# Altium schematic sheet MIXR Input - Board to Board Connectors.SchDoc: Processing & Power Board Connector
size B; Organization: Midnight Sun Solar Rayce Car Team; Address1: University of Waterloo; Address2: 200 University Ave W; Address3: Waterloo, ON, Canada; Address4: N2L 3E9; DocumentNumber: 2; SheetNumber: 2; SheetTotal: 14; Website: www.uwmidsun.com; ProjectName: ProjectName
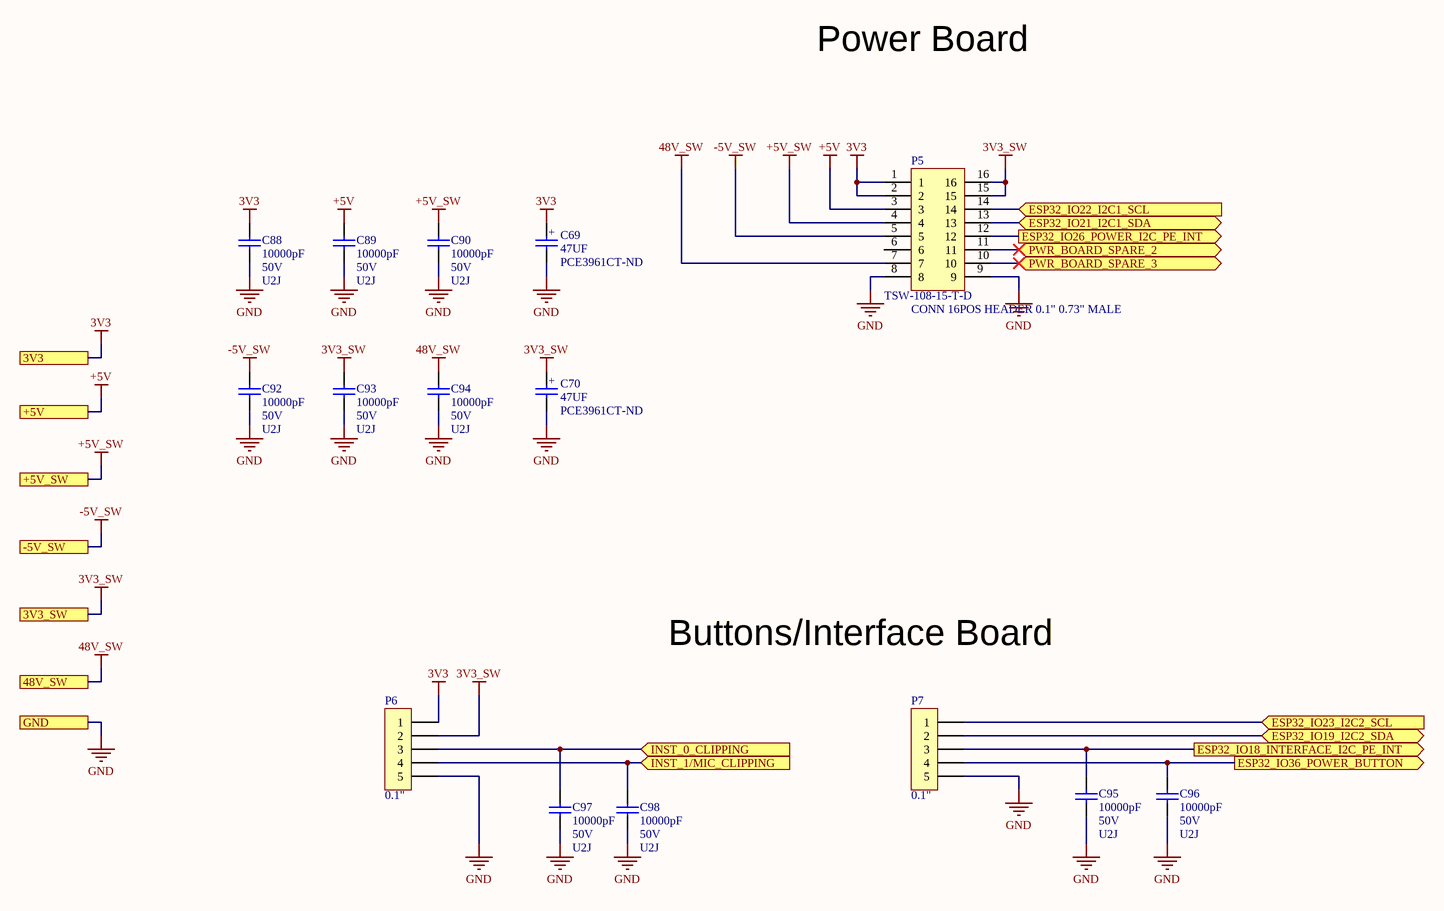
[diagram p0: MIXR Input - Board to Board Connectors.SchDoc]

## Parts
C69  47UF  Supplier Part Number 1: PCE3961CT-ND  [CAP ALUM 6.3MM RADIAL SMD]
C70  47UF  Supplier Part Number 1: PCE3961CT-ND  [CAP ALUM 6.3MM RADIAL SMD]
C88  Capacitance: 10000pF  Voltage: 50V  Temperature Coefficient: U2J  [CAP, 0603]  (hidden comment: CAP CER 10nF 50V 5% X7R 0603)
C89  Capacitance: 10000pF  Voltage: 50V  Temperature Coefficient: U2J  [CAP, 0603]  (hidden comment: CAP CER 10nF 50V 5% X7R 0603)
C90  Capacitance: 10000pF  Voltage: 50V  Temperature Coefficient: U2J  [CAP, 0603]  (hidden comment: CAP CER 10nF 50V 5% X7R 0603)
C92  Capacitance: 10000pF  Voltage: 50V  Temperature Coefficient: U2J  [CAP, 0603]  (hidden comment: CAP CER 10nF 50V 5% X7R 0603)
C93  Capacitance: 10000pF  Voltage: 50V  Temperature Coefficient: U2J  [CAP, 0603]  (hidden comment: CAP CER 10nF 50V 5% X7R 0603)
C94  Capacitance: 10000pF  Voltage: 50V  Temperature Coefficient: U2J  [CAP, 0603]  (hidden comment: CAP CER 10nF 50V 5% X7R 0603)
C95  Capacitance: 10000pF  Voltage: 50V  Temperature Coefficient: U2J  [CAP, 0603]  (hidden comment: CAP CER 10nF 50V 5% X7R 0603)
C96  Capacitance: 10000pF  Voltage: 50V  Temperature Coefficient: U2J  [CAP, 0603]  (hidden comment: CAP CER 10nF 50V 5% X7R 0603)
C97  Capacitance: 10000pF  Voltage: 50V  Temperature Coefficient: U2J  [CAP, 0603]  (hidden comment: CAP CER 10nF 50V 5% X7R 0603)
C98  Capacitance: 10000pF  Voltage: 50V  Temperature Coefficient: U2J  [CAP, 0603]  (hidden comment: CAP CER 10nF 50V 5% X7R 0603)
P5  CONN 16POS HEADER 0.1" 0.73" MALE  Manufacturer Part Number: TSW-108-15-T-D  [CONN, 16POS 0.100" 0.73" MALE]
P6  0.1"  [CONN, 5POS 1.23" 0.100" MALE Header]
P7  0.1"  [CONN, 5POS 1.23" 0.100" MALE Header]

## Ports
3V3, 3V3_SW, 48V_SW, +5V, +5V_SW, -5V_SW, ESP32_IO18_INTERFACE_I2C_PE_INT (out), ESP32_IO19_I2C2_SDA (bidir), ESP32_IO21_I2C1_SDA (bidir), ESP32_IO22_I2C1_SCL (in), ESP32_IO23_I2C2_SCL (in), ESP32_IO26_POWER_I2C_PE_INT (out), ESP32_IO36_POWER_BUTTON (out), GND, INST_0_CLIPPING (in), INST_1/MIC_CLIPPING (in), PWR_BOARD_SPARE_2 (bidir), PWR_BOARD_SPARE_3 (bidir)

## Nets
3V3: C69.1 C88.1 P5.1 P5.2 P6.1 ; port 3V3
3V3_SW: C70.1 C93.1 P5.15 P5.16 P6.2 ; port 3V3_SW
48V_SW: C94.1 P5.7 ; port 48V_SW
+5V: C89.1 P5.3 ; port +5V
+5V_SW: C90.1 P5.4 ; port +5V_SW
-5V_SW: C92.1 P5.5 ; port -5V_SW
GND: C69.2 C70.2 C88.2 C89.2 C90.2 C92.2 C93.2 C94.2 C95.2 C96.2 C97.2 C98.2 P5.8 P5.9 P6.5 P7.5 ; port GND
ESP32_IO18_INTERFACE_I2C_PE_INT: C95.1 P7.3 ; port ESP32_IO18_INTERFACE_I2C_PE_INT
ESP32_IO19_I2C2_SDA: P7.2 ; port ESP32_IO19_I2C2_SDA
ESP32_IO21_I2C1_SDA: P5.13 ; port ESP32_IO21_I2C1_SDA
ESP32_IO22_I2C1_SCL: P5.14 ; port ESP32_IO22_I2C1_SCL
ESP32_IO23_I2C2_SCL: P7.1 ; port ESP32_IO23_I2C2_SCL
ESP32_IO26_POWER_I2C_PE_INT: P5.12 ; port ESP32_IO26_POWER_I2C_PE_INT
ESP32_IO36_POWER_BUTTON: C96.1 P7.4 ; port ESP32_IO36_POWER_BUTTON
INST_0_CLIPPING: C97.1 P6.3 ; port INST_0_CLIPPING
INST_1/MIC_CLIPPING: C98.1 P6.4 ; port INST_1/MIC_CLIPPING
PWR_BOARD_SPARE_2: P5.11 ; port PWR_BOARD_SPARE_2
PWR_BOARD_SPARE_3: P5.10 ; port PWR_BOARD_SPARE_3

Not connected (* = marked no-connect by the designer): P5 6

## Notes on the sheet
- Power Board
- Buttons/Interface Board
- PROJECT
- DOCUMENT
- DRAWN BY
- LAST MODIFIED
- PART NUMBER
- REVISION
- SHEET
- VARIANT
- OF
- (in symbol CAP ALUM 47UF 20% 35V SMD) +

## Library data of the parts
C69 C70 = CAP ALUM 47UF 20% 35V SMD: 47µF 35V Aluminum Electrolytic Capacitors Radial, Can - SMD 1000 Hrs @ 85°C; Manufacturer: Panasonic; Manufacturer Part Number: EEE-1VA470WP; Tolerance: 20%; Ripple Current: 70mA; Life (Hours): 1000Hour; Supplier 1: Digi-Key; Stock 1: 2820; Pricing 1: 1=0.38, 10=0.263, 100=0.1579, 500=0.11846 (USD); Mount: Surface Mount,PCB; Case/Package: Radial; Contact Plating: Tin; Min Operating Temperature: -40°C; Max Operating Temperature: 85°C; Capacitance: 47uF; Voltage Rating (DC): 35V; Voltage Rating: 35V; Packaging: Tape and Reel; Package Quantity: 1; Ripple Current (AC): 70mA; Termination: SMD/SMT; Diameter: 6.3mm; Length: 5.5mm; Height: 5.4mm; Height - Seated (Max): 0.213inch; Radiation Hardening: No; REACH SVHC: Unknown; Lead Free: Lead Free; ComponentLink1URL: https://datasheet.ciiva.com/2983/aba0000ce2-2983926.pdf; ComponentLink1Description: https://datasheet.ciiva.com/2983/aba0000ce2-2983926.pdf; ComponentLink2URL: https://datasheet.ciiva.com/2983/aba0000ce2-2983927.pdf; ComponentLink2Description: https://datasheet.ciiva.com/2983/aba0000ce2-2983927.pdf; ComponentLink3URL: https://datasheet.ciiva.com/14598/70255710-14598937.pdf; ComponentLink3Description: https://datasheet.ciiva.com/14598/70255710-14598937.pdf; ComponentLink4URL: https://datasheet.ciiva.com/15165/getdatasheetpartid-86239-15165868.pdf; ComponentLink4Description: https://datasheet.ciiva.com/15165/getdatasheetpartid-86239-15165868.pdf; ComponentLink5URL: https://datasheet.ciiva.com/16507/aba0000ce2-16507965.pdf; ComponentLink5Description: https://datasheet.ciiva.com/16507/aba0000ce2-16507965.pdf; ComponentLink6URL: https://datasheet.ciiva.com/30206/11aba0000ce2-30206253.pdf; ComponentLink6Description: https://datasheet.ciiva.com/30206/11aba0000ce2-30206253.pdf
C88-C90 C92-C98 = CAP CER 10nF 50V 5% X7R 0603: 10000pF ±5% 50V Ceramic Capacitor U2J 0603 (1608 Metric); Manufacturer 1: KEMET; Manufacturer Part Number 1: C0603C103J5JAC7867; Supplier 1: Digi-Key; Supplier Part Number 1: 399-13384-1-ND; Packaging: Cut Tape (CT); Part Status: Active; Operating Temperature: -55°C ~ 125°C; Ratings: -; Failure Rate: -; Mounting Type: Surface Mount, MLCC; Package / Case: 0603 (1608 Metric); Size / Dimension: 0.063" L x 0.032" W (1.60mm x 0.80mm); Height - Seated (Max): -; Thickness (Max): 0.034" (0.87mm); Lead Spacing: -; Lead Style: -; ComponentLink1URL: http://www.kemet.com/docfinder?Partnumber=C0603C103J5JAC7867; ComponentLink1Description: http://www.kemet.com/docfinder?Partnumber=C0603C103J5JAC7867; Tolerance: ±5%
P5 = CONN 16POS HEADER 0.1" 0.73" MALE: SAMTEC         TSW-108-15-T-D             Board-To-Board Connector, Vertical, TSW Series, 16 Contacts, Header, 2.54 mm, Through Hole, 2 Rows; Max Current Rating: 7.6A; Number of Contacts: 16; Max Voltage Rating (AC): 550V; Pitch: 2.54mm; Supplier 1: Digi-Key; Supplier Part Number 1: SAM12336-ND; Packaging: Bulk; Number of Rows: 2; Termination: Solder; Contact Material: Bronze; ComponentLink1URL: https://datasheet.ciiva.com/15175/getdatasheetpartid-51138-15175898.pdf?src-supplier=Verical; ComponentLink1Description: https://datasheet.ciiva.com/15175/getdatasheetpartid-51138-15175898.pdf?src-supplier=Verical; Manufacturer: Samtec; RoHS: Yes; Category: Headers and Wire Housings; Stock 1: 387; Pricing 1: 1=1.02000, 10=0.89800, 100=0.77440, 500=0.63360, 1000=0.56320, 5000=0.49280, 10000=0.46816 (USD); Contact Plating: Tin; Housing Color: Black; Housing Material: Polyester; Min Operating Temperature: -55°C; Max Operating Temperature: 105°C; Orientation: Straight; Gender: Male; Length: 20.32mm; Depth: 5.08mm; Radiation Hardening: No; REACH SVHC: No SVHC
P6 P7 = CONN 5POS 0.1" 1" MALE HEADER: CONN HEADER 5POS .100" SNGL; Manufacturer: Samtec; Manufacturer Part Number: TSW-105-20-T-S; Number of Positions: 5; Gender: Male; Connector Type: Male Pin; Pitch: 0.1inch; System: Connector; RoHS: Yes; Category: Headers and Wire Housings; Stock 1: 939; Pricing 1: 1=0.45000, 10=0.42300, 100=0.32430, 500=0.28200, 1000=0.23265, 5000=0.20445, 10000=0.19035 (USD); Mount: Through Hole; Color: Black; Contact Plating: Tin; Contact Material: Bronze; Package Quantity: 1; Number of Rows: 1; Packaging: Rail/Tube; Termination: Solder; Number of Contacts: 5; Contact Mating Length: 1.02inch; Radiation Hardening: No; REACH SVHC: No SVHC; Lead Free: Lead Free; ComponentLink1URL: https://datasheet.ciiva.com/739/tsw-xxx-xx-xxx-x-xx-xxx-mkt-739939.pdf?src-supplier=Digi-Key; ComponentLink1Description: https://datasheet.ciiva.com/739/tsw-xxx-xx-xxx-x-xx-xxx-mkt-739939.pdf?src-supplier=Digi-Key; ComponentLink2URL: https://datasheet.ciiva.com/29947/htsw-th-29947990.pdf?src-supplier=Avnet; ComponentLink2Description: https://datasheet.ciiva.com/29947/htsw-th-29947990.pdf?src-supplier=Avnet; Supplier 1: Digi-Key; Supplier Part Number 1: SAM9000-ND